# EAGLE design LayerOne_2011 (EAGLE 5.11)
MOUSER: 556-ATMEGA64A-AU; OC_NEWARK: unknown

## Sheet 1 of 5
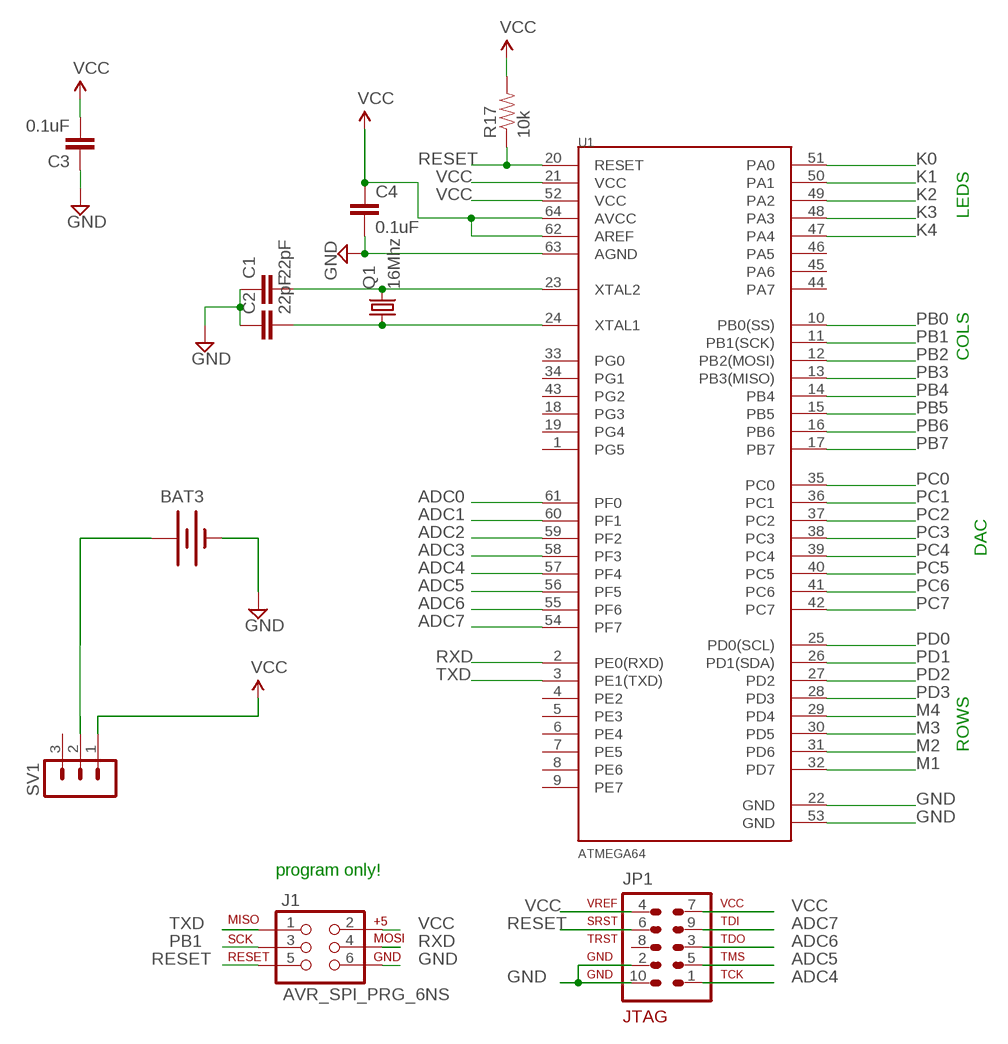
[diagram p0: schematic, sheet 1]

### Parts
BAT3  BATTERYCR123A  [BATTERY_CR123A]
C1  22pF  CAP0805  [0805]
C2  22pF  CAP0805  [0805]
C3  0.1uF  CAP0805  [0805]
C4  0.1uF  CAP0805  [0805]
J1  AVR_SPI_PRG_6NS  [2X3-NS]
JP1  debug  AVR-JTAG-10  [AVR-JTAG-10]
Q1  16Mhz  CRYSTALSMD  [HC49UP]
R17  10k  RESISTOR  [0805]
SV1  MA03-1  [MA03-1]
U1  ATMEGA64  ATMEGA128-SMD  [TQFP64_14X14MM]

### Nets
3V: BAT3.+ SV1.2
ADC0: U1.61(PF0) ; also sheet 5
ADC1: U1.60(PF1) ; also sheet 5
ADC2: U1.59(PF2) ; also sheet 5
ADC3: U1.58(PF3) ; also sheet 5
ADC4: JP1.1 U1.57(PF4) ; also sheet 5
ADC5: JP1.5 U1.56(PF5) ; also sheet 5
ADC6: JP1.3 U1.55(PF6) ; also sheet 5
ADC7: JP1.9 U1.54(PF7) ; also sheet 5
GND: BAT3.- C1.1 C2.1 C3.1 C4.2 J1.6 JP1.2 JP1.10 U1.22(GND) U1.53(GND) U1.63(AGND) ; also sheet 2,5
K0 [LED]: U1.51(PA0) ; also sheet 4
K1 [LED]: U1.50(PA1) ; also sheet 4
K2 [LED]: U1.49(PA2) ; also sheet 4
K3 [LED]: U1.48(PA3) ; also sheet 4
K4 [LED]: U1.47(PA4) ; also sheet 4
M1: U1.32(PD7) ; also sheet 3
M2: U1.31(PD6) ; also sheet 3
M3: U1.30(PD5) ; also sheet 3
M4: U1.29(PD4) ; also sheet 3
N$15: C2.2 Q1.1 U1.24(XTAL1)
N$55: C1.2 Q1.2 U1.23(XTAL2)
PB0: U1.10(PB0(SS)) ; also sheet 3
PB1: J1.3 U1.11(PB1(SCK)) ; also sheet 3
PB2: U1.12(PB2(MOSI)) ; also sheet 3
PB3: U1.13(PB3(MISO)) ; also sheet 3
PB4: U1.14(PB4)
PB5: U1.15(PB5)
PB6: U1.16(PB6)
PB7: U1.17(PB7)
PC0: U1.35(PC0) ; also sheet 2
PC1: U1.36(PC1) ; also sheet 2
PC2: U1.37(PC2) ; also sheet 2
PC3: U1.38(PC3) ; also sheet 2
PC4: U1.39(PC4) ; also sheet 2
PC5: U1.40(PC5) ; also sheet 2
PC6: U1.41(PC6) ; also sheet 2
PC7: U1.42(PC7) ; also sheet 2
PD0: U1.25(PD0(SCL))
PD1: U1.26(PD1(SDA))
PD2: U1.27(PD2)
PD3: U1.28(PD3)
RESET: J1.5 JP1.6 R17.1 U1.20(RESET)
RXD: J1.4 U1.2(PE0(RXD))
TXD: J1.1 U1.3(PE1(TXD))
VCC: C3.2 C4.1 J1.2 JP1.4 JP1.7 R17.2 SV1.1 U1.21(VCC) U1.52(VCC) U1.62(AREF) U1.64(AVCC) ; also sheet 5
Unconnected: JP1.8 SV1.3 U1.1(PG5) U1.4(PE2) U1.5(PE3) U1.6(PE4) U1.7(PE5) U1.8(PE6) U1.9(PE7) U1.18(PG3) U1.19(PG4) U1.33(PG0) U1.34(PG1) U1.43(PG2) U1.44(PA7) U1.45(PA6) U1.46(PA5)

### Notes on the sheet
- LEDS
- COLS
- DAC
- ROWS
- program only!

## Sheet 2 of 5
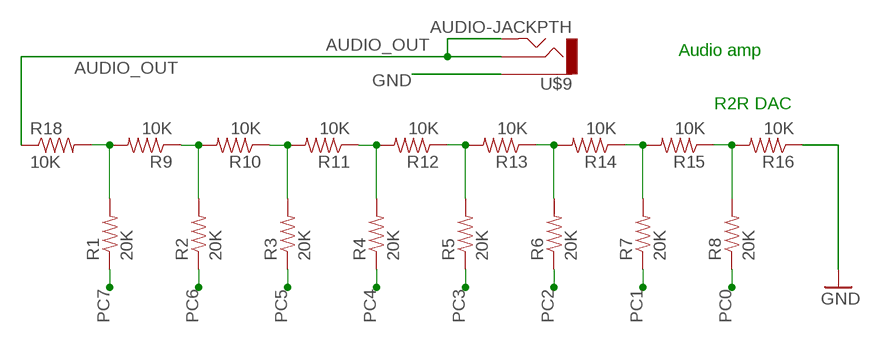
[diagram p1: schematic, sheet 2]

### Parts
R1  20K  RESISTOR  [0805]
R2  20K  RESISTOR  [0805]
R3  20K  RESISTOR  [0805]
R4  20K  RESISTOR  [0805]
R5  20K  RESISTOR  [0805]
R6  20K  RESISTOR  [0805]
R7  20K  RESISTOR  [0805]
R8  20K  RESISTOR  [0805]
R9  10K  RESISTOR  [0805]
R10  10K  RESISTOR  [0805]
R11  10K  RESISTOR  [0805]
R12  10K  RESISTOR  [0805]
R13  10K  RESISTOR  [0805]
R14  10K  RESISTOR  [0805]
R15  10K  RESISTOR  [0805]
R16  10K  RESISTOR  [0805]
R18  10K  RESISTOR  [0805]
U$9  AUDIO-JACKPTH  LAYERONE_2011_AUDIO-JACKPTH  [LAYERONE_2011_AUDIO-JACK]

### Nets
AUDIO_OUT: R18.1 U$9.2 U$9.5
GND: R16.1 U$9.1 ; also sheet 1,5
N$1: R2.2 R9.1 R10.2
N$2: R3.2 R10.1 R11.2
N$3: R4.2 R11.1 R12.2
N$4: R5.2 R12.1 R13.2
N$5: R6.2 R13.1 R14.2
N$6: R7.2 R14.1 R15.2
N$7: R8.2 R15.1 R16.2
N$53: R1.2 R9.2 R18.2
PC0: R8.1 ; also sheet 1
PC1: R7.1 ; also sheet 1
PC2: R6.1 ; also sheet 1
PC3: R5.1 ; also sheet 1
PC4: R4.1 ; also sheet 1
PC5: R3.1 ; also sheet 1
PC6: R2.1 ; also sheet 1
PC7: R1.1 ; also sheet 1

### Notes on the sheet
- Audio amp
- R2R DAC

## Sheet 3 of 5
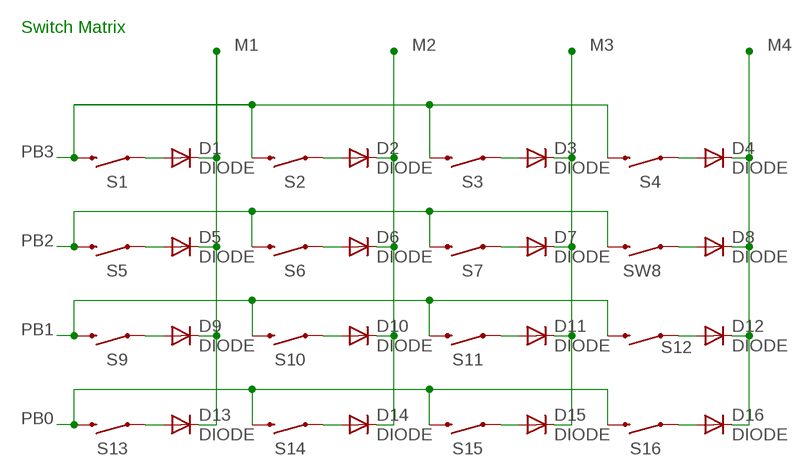
[diagram p2: schematic, sheet 3]

### Parts
D1  DIODE  DIODESOD  [SOD-323]
D2  DIODE  DIODESOD  [SOD-323]
D3  DIODE  DIODESOD  [SOD-323]
D4  DIODE  DIODESOD  [SOD-323]
D5  DIODE  DIODESOD  [SOD-323]
D6  DIODE  DIODESOD  [SOD-323]
D7  DIODE  DIODESOD  [SOD-323]
D8  DIODE  DIODESOD  [SOD-323]
D9  DIODE  DIODESOD  [SOD-323]
D10  DIODE  DIODESOD  [SOD-323]
D11  DIODE  DIODESOD  [SOD-323]
D12  DIODE  DIODESOD  [SOD-323]
D13  DIODE  DIODESOD  [SOD-323]
D14  DIODE  DIODESOD  [SOD-323]
D15  DIODE  DIODESOD  [SOD-323]
D16  DIODE  DIODESOD  [SOD-323]
S1  wave A saw/squ  SWITCH-MOMENTARY-2SMD  [TACTILE_SWITCH_SMD]
S2  osc b on/off  SWITCH-MOMENTARY-2SMD  [TACTILE_SWITCH_SMD]
S3  modwheel  SWITCH-MOMENTARY-2SMD  [TACTILE_SWITCH_SMD]
S4  transpose down/up  SWITCH-MOMENTARY-2SMD  [TACTILE_SWITCH_SMD]
S5  wave B square/saw  SWITCH-MOMENTARY-2SMD  [TACTILE_SWITCH_SMD]
S6  octave B down  SWITCH-MOMENTARY-2SMD  [TACTILE_SWITCH_SMD]
S7  OSCA noise toggle  SWITCH-MOMENTARY-2SMD  [TACTILE_SWITCH_SMD]
S9  DCF KBD TRACK off/on  SWITCH-MOMENTARY-2SMD  [TACTILE_SWITCH_SMD]
S10  DCF HP/LP  SWITCH-MOMENTARY-2SMD  [TACTILE_SWITCH_SMD]
S11  LFO Mod DCO/DCF  SWITCH-MOMENTARY-2SMD  [TACTILE_SWITCH_SMD]
S12  LFO KBD Sync  SWITCH-MOMENTARY-2SMD  [TACTILE_SWITCH_SMD]
S13  DCO distort toggle  SWITCH-MOMENTARY-2SMD  [TACTILE_SWITCH_SMD]
S14  knob bank shift  SWITCH-MOMENTARY-2SMD  [TACTILE_SWITCH_SMD]
S15  LFO WAVE tri/squa  SWITCH-MOMENTARY-2SMD  [TACTILE_SWITCH_SMD]
S16  LFO Normal/Rand  SWITCH-MOMENTARY-2SMD  [TACTILE_SWITCH_SMD]
SW8  DCA Gate/env  SWITCH-MOMENTARY-2SMD  [TACTILE_SWITCH_SMD]

### Nets
M1: D1.1(C) D5.1(C) D9.1(C) D13.1(C) ; also sheet 1
M2: D2.1(C) D6.1(C) D10.1(C) D14.1(C) ; also sheet 1
M3: D3.1(C) D7.1(C) D11.1(C) D15.1(C) ; also sheet 1
M4: D4.1(C) D8.1(C) D12.1(C) D16.1(C) ; also sheet 1
N$13: D1.2(A) S1.1
N$16: D2.2(A) S2.1
N$17: D3.2(A) S3.1
N$18: D4.2(A) S4.1
N$19: D5.2(A) S5.1
N$20: D6.2(A) S6.1
N$21: D7.2(A) S7.1
N$22: D8.2(A) SW8.1
N$23: D9.2(A) S9.1
N$24: D10.2(A) S10.1
N$25: D11.2(A) S11.1
N$26: D12.2(A) S12.1
N$33: D13.2(A) S13.1
N$34: D14.2(A) S14.1
N$35: D15.2(A) S15.1
N$36: D16.2(A) S16.1
PB0: S13.3 S14.3 S15.3 S16.3 ; also sheet 1
PB1: S9.3 S10.3 S11.3 S12.3 ; also sheet 1
PB2: S5.3 S6.3 S7.3 SW8.3 ; also sheet 1
PB3: S1.3 S2.3 S3.3 S4.3 ; also sheet 1

### Notes on the sheet
- Switch Matrix

## Sheet 4 of 5
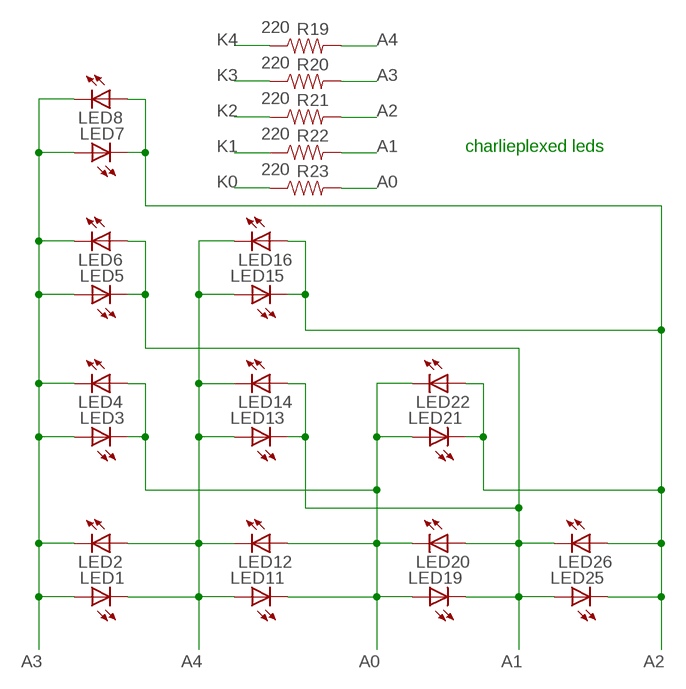
[diagram p3: schematic, sheet 4]

### Parts
LED1  LEDCHIPLED_1206  [CHIPLED_1206]
LED2  LEDCHIPLED_1206  [CHIPLED_1206]
LED3  LEDCHIPLED_1206  [CHIPLED_1206]
LED4  LEDCHIPLED_1206  [CHIPLED_1206]
LED5  LEDCHIPLED_1206  [CHIPLED_1206]
LED6  LEDCHIPLED_1206  [CHIPLED_1206]
LED7  LEDCHIPLED_1206  [CHIPLED_1206]
LED8  LEDCHIPLED_1206  [CHIPLED_1206]
LED11  LEDCHIPLED_1206  [CHIPLED_1206]
LED12  LEDCHIPLED_1206  [CHIPLED_1206]
LED13  LEDCHIPLED_1206  [CHIPLED_1206]
LED14  LEDCHIPLED_1206  [CHIPLED_1206]
LED15  LEDCHIPLED_1206  [CHIPLED_1206]
LED16  LEDCHIPLED_1206  [CHIPLED_1206]
LED19  LEDCHIPLED_1206  [CHIPLED_1206]
LED20  LEDCHIPLED_1206  [CHIPLED_1206]
LED21  LEDCHIPLED_1206  [CHIPLED_1206]
LED22  LEDCHIPLED_1206  [CHIPLED_1206]
LED25  LEDCHIPLED_1206  [CHIPLED_1206]
LED26  LEDCHIPLED_1206  [CHIPLED_1206]
R19  220  RESISTOR  [0805]
R20  220  RESISTOR  [0805]
R21  220  RESISTOR  [0805]
R22  220  RESISTOR  [0805]
R23  220  RESISTOR  [0805]

### Nets
A0 [LED]: LED3.C LED4.A LED11.C LED12.A LED19.A LED20.C LED21.A LED22.C R23.2
A1: LED5.C LED6.A LED13.C LED14.A LED19.C LED20.A LED25.A LED26.C R22.2
A2: LED7.C LED8.A LED15.C LED16.A LED21.C LED22.A LED25.C LED26.A R21.2
A3: LED1.A LED2.C LED3.A LED4.C LED5.A LED6.C LED7.A LED8.C R20.2
A4: LED1.C LED2.A LED11.A LED12.C LED13.A LED14.C LED15.A LED16.C R19.2
K0 [LED]: R23.1 ; also sheet 1
K1 [LED]: R22.1 ; also sheet 1
K2 [LED]: R21.1 ; also sheet 1
K3 [LED]: R20.1 ; also sheet 1
K4 [LED]: R19.1 ; also sheet 1

### Notes on the sheet
- charlieplexed leds

## Sheet 5 of 5
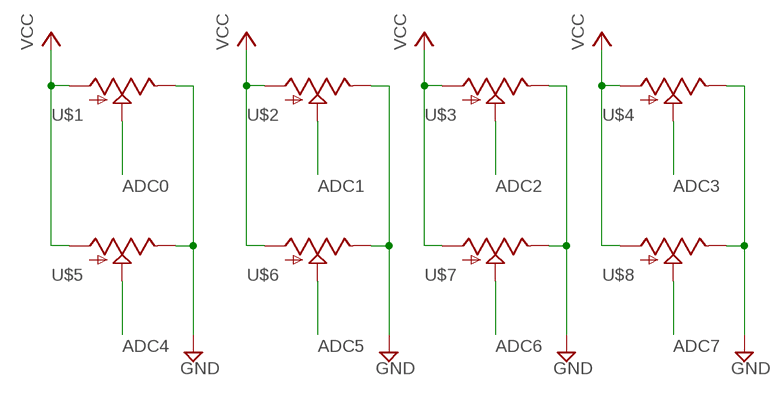
[diagram p4: schematic, sheet 5]

### Parts
U$1  LAYERONE_2011_POTPOT_GOLD  [LAYERONE_2011_POT_GOLD]
U$2  LAYERONE_2011_POTPOT_GOLD  [LAYERONE_2011_POT_GOLD]
U$3  LAYERONE_2011_POTPOT_GOLD  [LAYERONE_2011_POT_GOLD]
U$4  LAYERONE_2011_POTPOT_GOLD  [LAYERONE_2011_POT_GOLD]
U$5  LAYERONE_2011_POTPOT_GOLD  [LAYERONE_2011_POT_GOLD]
U$6  LAYERONE_2011_POTPOT_GOLD  [LAYERONE_2011_POT_GOLD]
U$7  LAYERONE_2011_POTPOT_GOLD  [LAYERONE_2011_POT_GOLD]
U$8  LAYERONE_2011_POTPOT_GOLD  [LAYERONE_2011_POT_GOLD]

### Nets
ADC0: U$1.P$2(S) ; also sheet 1
ADC1: U$2.P$2(S) ; also sheet 1
ADC2: U$3.P$2(S) ; also sheet 1
ADC3: U$4.P$2(S) ; also sheet 1
ADC4: U$5.P$2(S) ; also sheet 1
ADC5: U$6.P$2(S) ; also sheet 1
ADC6: U$7.P$2(S) ; also sheet 1
ADC7: U$8.P$2(S) ; also sheet 1
GND: U$1.P$3(E) U$2.P$3(E) U$3.P$3(E) U$4.P$3(E) U$5.P$3(E) U$6.P$3(E) U$7.P$3(E) U$8.P$3(E) ; also sheet 1,2
VCC: U$1.P$1(A) U$2.P$1(A) U$3.P$1(A) U$4.P$1(A) U$5.P$1(A) U$6.P$1(A) U$7.P$1(A) U$8.P$1(A) ; also sheet 1

## Library data of the parts
BAT3 = tvbgone-adj:BATTERY: Battery Holders Various common sizes : AA, AAA, 20mm coin cell and 12mm coin cell.
C1-C3 = SparkFun:CAP: Capacitor Standard 0603 ceramic capacitor, and 0.1" leaded capacitor.
C4 = NSL_Cylon:CAP: Capacitor Standard 0603 ceramic capacitor, and 0.1" leaded capacitor.
D1-D16 = SparkFun:DIODE: Diode These are standard reverse protection diodes and small signal diodes. SMA package can handle up to about 1A. SOD-323 can handle about 200mA. What the SOD-323 package when ordering, there are some mfgs out there that are 5-pin packages.
J1 = LayerOne_2011:AVR_SPI_PRG_6: AVR ISP 6 Pin This is the reduced ISP connector for AVR programming. Common on Arduino. This footprint will take up less PCB space and can be used with a 10-pin to 6-pin adapter such as SKU: BOB-08508
JP1 = avr-6:AVR-JTAG-10: AVR JTAG Debug/Programming Header
LED1-LED8 LED11-LED16 LED19-LED22 LED25 LED26 = led:LED: LED OSRAM: - CHIPLED LG R971, LG N971, LY N971, LG Q971, LY Q971, LO R971, LY R971 LH N974, LH R974 LS Q976, LO Q976, LY Q976 LO Q996 - Hyper CHIPLED LW Q18S LB Q993, LB Q99A, LB R99A - SideLED LS A670, LO A670, LY A670, LG A670, LP A670 LB A673, LV A673, LT A673, LW A673 LH A674 LY A675 LS A676, LA A676, LO A676, LY A676, LW A676 LS A679, LY A679, LG A679 - Hyper Micro SIDELED® LS Y876, LA Y876, LO Y876, LY Y876 LT Y87S - SmartLED LW L88C, LW L88S LB L89C, LB L89S, LG L890 LS L89K, LO L89K, LY L89K LS L896, LA L896, LO L896, LY L896 - TOPLED LS T670, LO T670, LY T670, LG T670, LP T670 LSG T670, LSP T670, LSY T670, LOP T670, LYG T670 LG T671, LOG T671, LSG T671 LB T673, LV T673, LT T673, LW T673 LH T674 LS T676, LA T676, LO T676, LY T676, LB T676, LH T676, LSB T676, LW T676 LB T67C, LV T67C, LT T67C, LS T67K, LO T67K, LY T67K, LW E67C LS E67B, LA E67B, LO E67B, LY E67B, LB E67C, LV E67C, LT E67C LW T67C LS T679, LY T679, LG T679 LS T770, LO T770, LY T770, LG T770, LP T770 LB T773, LV T773, LT T773, LW T773 LH T774 LS E675, LA E675, LY E675, LS T675 LS T776, LA T776, LO T776, LY T776, LB T776 LHGB T686 LT T68C, LB T68C - Hyper Mini TOPLED® LB M676 - Mini TOPLED Santana® LG M470 LS M47K, LO M47K, LY M47K Source: http://www.osram.convergy.de LUXEON: - LUMILED® LXK2-PW12-R00, LXK2-PW12-S00, LXK2-PW14-U00, LXK2-PW14-V00 LXK2-PM12-R00, LXK2-PM12-S00, LXK2-PM14-U00 LXK2-PE12-Q00, LXK2-PE12-R00, LXK2-PE12-S00, LXK2-PE14-T00, LXK2-PE14-U00 LXK2-PB12-K00, LXK2-PB12-L00, LXK2-PB12-M00, LXK2-PB14-N00, LXK2-PB14-P00, LXK2-PB14-Q00 LXK2-PR12-L00, LXK2-PR12-M00, LXK2-PR14-Q00, LXK2-PR14-R00 LXK2-PD12-Q00, LXK2-PD12-R00, LXK2-PD12-S00 LXK2-PH12-R00, LXK2-PH12-S00 LXK2-PL12-P00, LXK2-PL12-Q00, LXK2-PL12-R00 Source: www.luxeon.com KINGBRIGHT: KA-3528ASYC Source: www.kingbright.com
Q1 = LayerOne_2011:CRYSTAL: Crystals Various standard crystals. Proven footprints. Spark Fun Electronics SKU : COM-00534
R1-R17 = SparkFun:RESISTOR: Resistor Basic schematic elements and footprints for 0603, 1206, and PTH 1/10th watt (small) resistors.
R18 = LayerOne_2011:RESISTOR: Resistor Basic schematic elements and footprints for 0603, 1206, and PTH 1/10th watt (small) resistors.
R19-R23 = NSL:RESISTOR: Resistor Basic schematic elements and footprints for 0603, 1206, and PTH 1/10th watt (small) resistors.
S1-S7 S9-S16 SW8 = SparkFun:SWITCH-MOMENTARY-2
SV1 = con-lstb:MA03-1: PIN HEADER; OC_FARNELL: unknown; OC_NEWARK: unknown
U1 = LayerOne_2011:ATMEGA128: ATmega128/128L/1281/2561. Note: The ATmega128 pin 1 is PEN and the ATmega256/1281 pin 1 is PG5.
U$1-U$8 = LayerOne_2011:LAYERONE_2011_POT
U$9 = LayerOne_2011:LAYERONE_2011_AUDIO-JACK: 3.5mm Audio Jack Simple 3.5mm common PCB mount audio jack. SKU: PRT-08032

## Net classes
0 default: width 0.406 mm
1 LED: width 0.305 mm

## Board
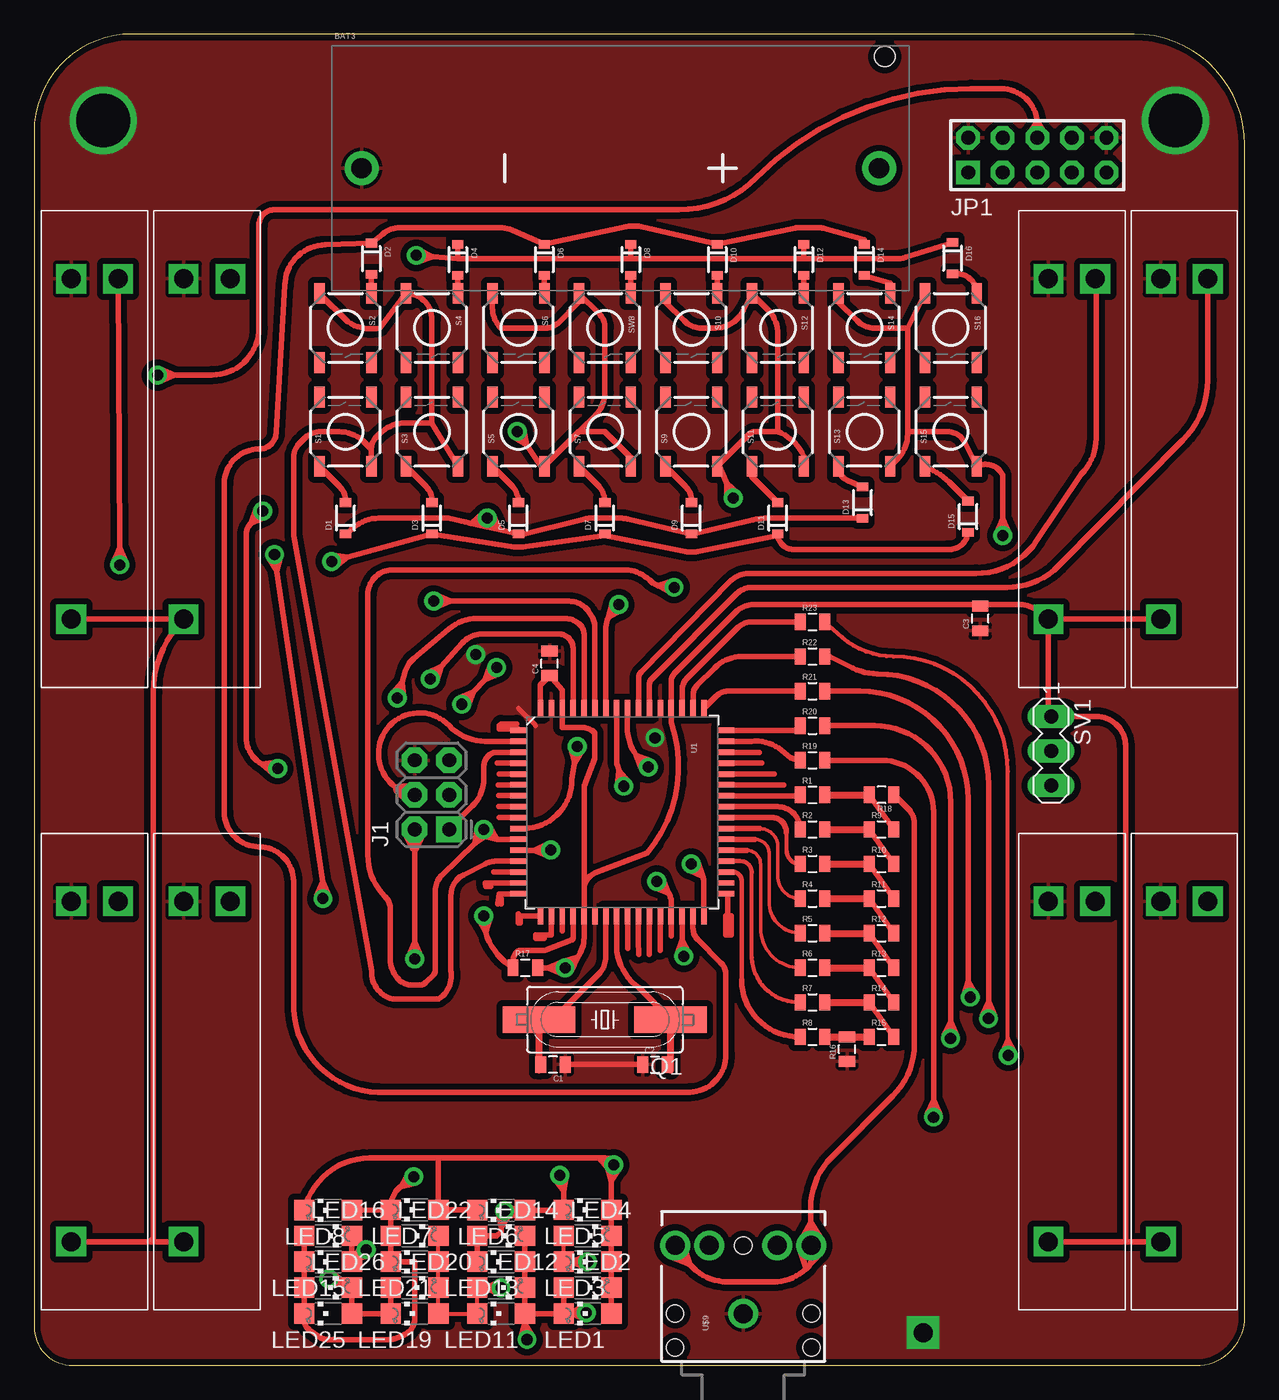
[diagram p5: board, top side]
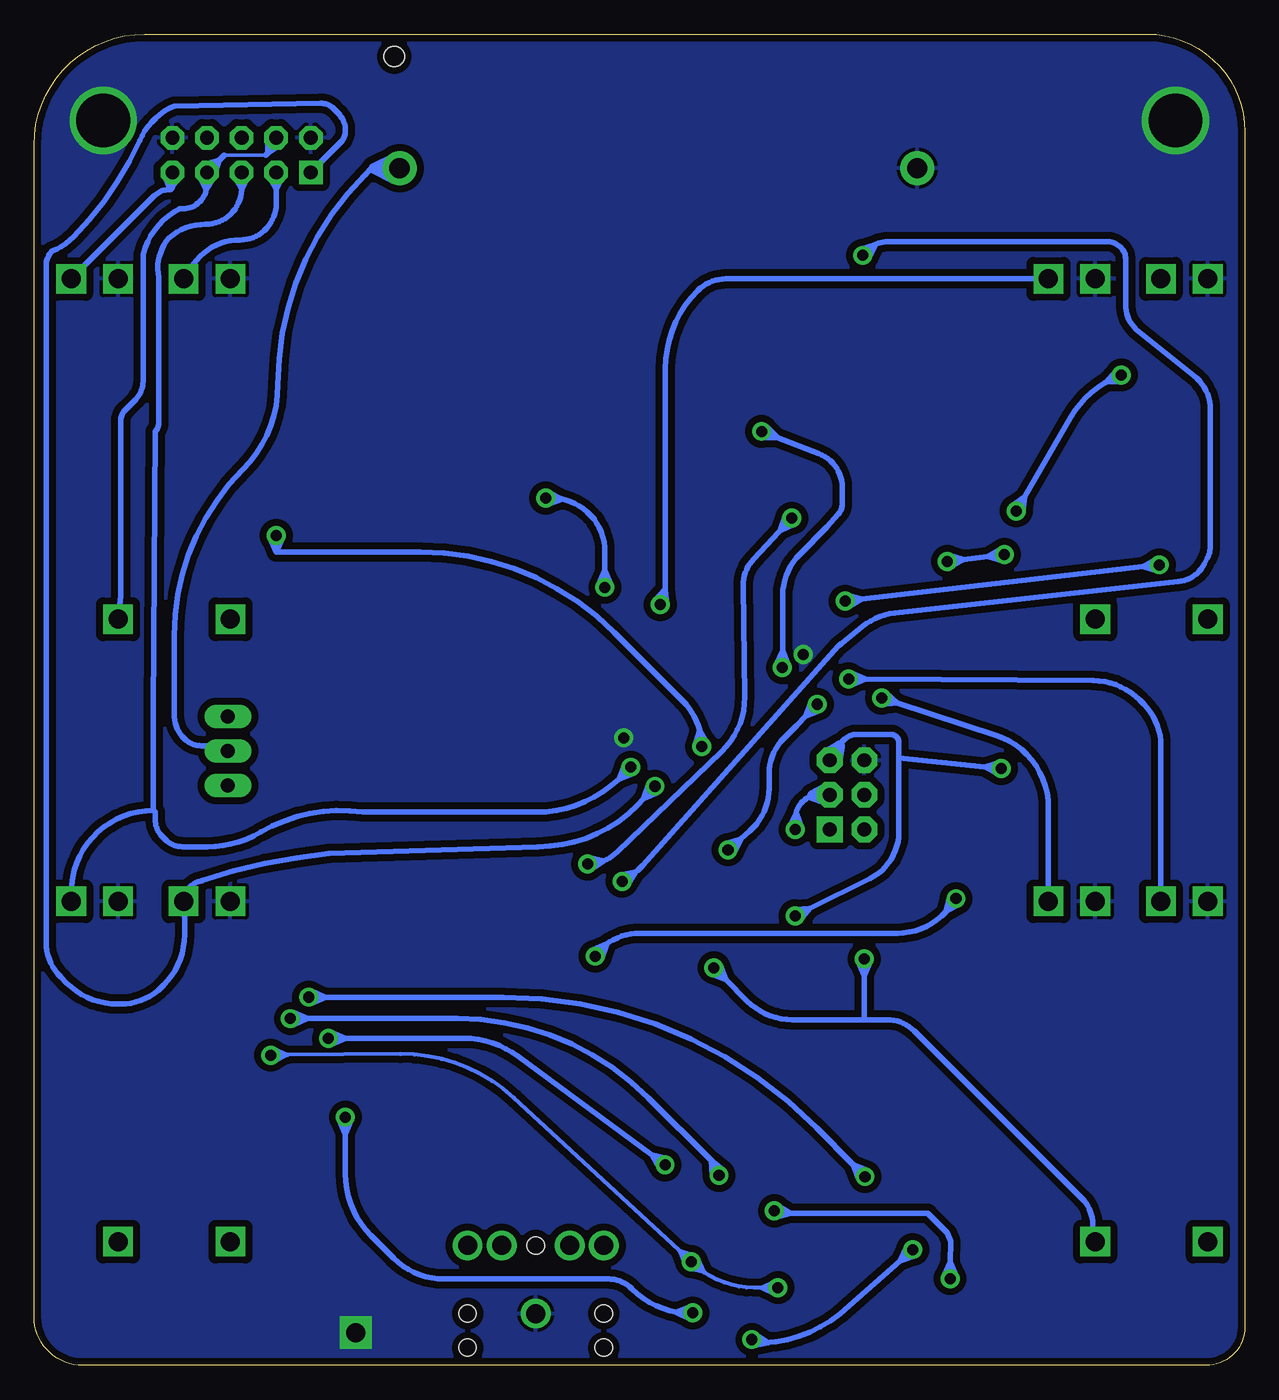
[diagram p6: board, bottom side, seen from below]

Size 88.9 x 97.79 mm. Coordinates in mm from the lower left corner, seen from the top.
Outline: 85.31,0 arc90 88.9,3.59 88.9,89.66 arc90 80.77,97.79 7.18,97.79 arc90 0,90.61 0,2.84 arc90 2.84,0 85.31,0
Copper layers (1*16): Top 0.0356mm / dielectric 1.5011mm / Bottom 0.0356mm
Design rules "SparkFun-mod *": minimum track width 8mil, minimum drill 32mil, track to track 14mil, track to pad 14mil, pad to pad 12mil, via to via 12mil, smd to smd 8mil, copper to edge 12mil, drill to drill 8mil, minimum pad ring 14mil, minimum via ring 10mil, stop-mask expansion 25mil, vias tented up to drill 34mil, thermal gap 10mil
Milling: 8 lines

### Footprints (pad centres in the part's own frame; a part is rotated, then mirrored left to right if it is on the bottom)
BATTERY_CR123A = drill 1.5 pad 2.5 round: + 19,0; - -19,0 | hole 1.5: 19.4,8.2
0805 = smd 0.8 x 1.2: 1 -0.9,0; 2 0.9,0
SOD-323 = smd 0.63 x 0.83: 1 -1.15,0; 2 1.15,0
2X3-NS = drill 1.016 pad 1.88 square: 1 -2.54,-1.27 | drill 1.016 pad 1.88 octagon: 2 -2.54,1.27; 3 0,-1.27; 4 0,1.27; 5 2.54,-1.27; 6 2.54,1.27
AVR-JTAG-10 = drill 1.016 square: 1 -5.08,-1.27 | drill 1.016 octagon: 2 -5.08,1.27; 3 -2.54,-1.27; 4 -2.54,1.27; 5 0,-1.27; 6 0,1.27; 7 2.54,-1.27; 8 2.54,1.27; 9 5.08,-1.27; 10 5.08,1.27
CHIPLED_1206 = smd 1.5 x 1.5: A 0,-1.75; C 0,1.75
HC49UP = smd 5.334 x 1.93: 1 -4.826,0; 2 4.826,0
TACTILE_SWITCH_SMD = smd 1.524 x 0.762: 1 -2.54,1.905; 2 2.54,1.905; 3 -2.54,-1.905; 4 2.54,-1.905
MA03-1 = drill 1.016 long: 1 -2.54,0; 2 0,0; 3 2.54,0
TQFP64_14X14MM = smd 0.4 x 1.27: 1 -6,-7.6; 2 -5.2,-7.6; 3 -4.4,-7.6; 4 -3.6,-7.6; 5 -2.8,-7.6; 6 -2,-7.6; 7 -1.2,-7.6; 8 -0.4,-7.6; 9 0.4,-7.6; 10 1.2,-7.6; 11 2,-7.6; 12 2.8,-7.6; 13 3.6,-7.6; 14 4.4,-7.6; 15 5.2,-7.6; 16 6,-7.6; 33 6,7.6; 34 5.2,7.6; 35 4.4,7.6; 36 3.6,7.6; 37 2.8,7.6; 38 2,7.6; 39 1.2,7.6; 40 0.4,7.6; 41 -0.4,7.6; 42 -1.2,7.6; 43 -2,7.6; 44 -2.8,7.6; 45 -3.6,7.6; 46 -4.4,7.6; 47 -5.2,7.6; 48 -6,7.6 | smd 1.27 x 0.4: 17 7.6,-6; 18 7.6,-5.2; 19 7.6,-4.4; 20 7.6,-3.6; 21 7.6,-2.8; 22 7.6,-2; 23 7.6,-1.2; 24 7.6,-0.4; 25 7.6,0.4; 26 7.6,1.2; 27 7.6,2; 28 7.6,2.8; 29 7.6,3.6; 30 7.6,4.4; 31 7.6,5.2; 32 7.6,6; 49 -7.6,6; 50 -7.6,5.2; 51 -7.6,4.4; 52 -7.6,3.6; 53 -7.6,2.8; 54 -7.6,2; 55 -7.6,1.2; 56 -7.6,0.4; 57 -7.6,-0.4; 58 -7.6,-1.2; 59 -7.6,-2; 60 -7.6,-2.8; 61 -7.6,-3.6; 62 -7.6,-4.4; 63 -7.6,-5.2; 64 -7.6,-6
LAYERONE_2011_POT_GOLD = drill 1.397 square: P$1 12.5,-1.72; P$2 -12.5,1.72; P$3 -12.5,-1.72
LAYERONE_2011_AUDIO-JACK = drill 1.397 pad 2.184 round: 1 0,0; 2 5,5; 3 5,2.5; 4 5,-2.5; 5 5,-5 | hole 1.27: 0,5; -2.5,5; -2.5,-5; 0,-5; 5,0

### Placement (x,y rotation side)
BAT3  43.05,87.93 0 top
C1  38.1,22.1 180 top
C2  45.59,22.1 0 top
C3  69.47,54.86 90 top
C4  37.85,51.56 90 top
D1  22.86,62.23 90 top
D2  24.77,81.28 270 top
D3  29.21,62.23 90 top
D4  31.11,81.2 270 top
D5  35.56,62.23 90 top
D6  37.46,81.2 270 top
D7  41.91,62.23 90 top
D8  43.81,81.2 270 top
D9  48.26,62.23 90 top
D10  50.16,81.2 270 top
D11  54.61,62.23 90 top
D12  56.52,81.2 270 top
D13  60.83,63.37 90 top
D14  60.96,81.2 270 top
D15  68.58,62.34 90 top
D16  67.44,81.33 270 top
J1  29.21,41.91 90 top
JP1  73.66,88.9 0 top
LED1  40.64,3.81 90 top
LED2  40.64,5.71 270 top
LED3  40.64,7.62 90 top
LED4  40.64,9.53 270 top
LED5  40.64,11.43 90 top
LED6  34.29,11.4 90 top
LED7  27.94,11.43 90 top
LED8  21.59,11.4 90 top
LED11  34.29,3.81 90 top
LED12  34.29,5.71 270 top
LED13  34.29,7.62 90 top
LED14  34.29,9.53 270 top
LED15  21.59,7.62 90 top
LED16  21.59,9.53 270 top
LED19  27.94,3.81 90 top
LED20  27.94,5.71 270 top
LED21  27.94,7.62 90 top
LED22  27.94,9.53 270 top
LED25  21.59,3.81 90 top
LED26  21.59,5.71 270 top
Q1  41.91,25.4 180 top
R1  4.7K  [0805]  57.15,41.91 0 top
R2  4.7K  [0805]  57.15,39.37 0 top
R3  4.7K  [0805]  57.15,36.83 0 top
R4  4.7K  [0805]  57.15,34.29 0 top
R5  4.7K  [0805]  57.15,31.75 0 top
R6  4.7K  [0805]  57.15,29.21 0 top
R7  4.7K  [0805]  57.15,26.67 0 top
R8  4.7K  [0805]  57.15,24.13 0 top
R9  2.4K  [0805]  62.23,39.37 0 top
R10  2.4K  [0805]  62.23,36.83 0 top
R11  2.4K  [0805]  62.23,34.29 0 top
R12  2.4K  [0805]  62.23,31.75 0 top
R13  2.4K  [0805]  62.23,29.21 0 top
R14  2.4K  [0805]  62.23,26.67 0 top
R15  2.4K  [0805]  62.23,24.13 0 top
R16  2.4K  [0805]  59.69,23.24 90 top
R17  36.07,29.21 0 top
R18  0K  [0805]  62.23,41.91 180 top
R19  57.15,44.45 0 top
R20  57.15,46.99 0 top
R21  57.15,49.53 0 top
R22  57.15,52.07 0 top
R23  57.15,54.61 0 top
S1  22.86,68.58 90 top
S2  22.86,76.2 270 top
S3  29.21,68.58 90 top
S4  29.21,76.2 270 top
S5  35.56,68.58 90 top
S6  35.56,76.2 270 top
S7  41.91,68.58 90 top
S9  48.26,68.58 90 top
S10  48.26,76.2 270 top
S11  54.61,68.58 90 top
S12  54.61,76.2 270 top
S13  60.96,68.58 90 top
S14  60.96,76.2 270 top
S15  67.31,68.58 90 top
S16  67.31,76.2 270 top
SV1  74.68,45.14 270 top
SW8  41.91,76.2 270 top
U1  43.18,40.64 270 top
U$1  4.45,21.59 270 top
U$2  12.7,21.59 270 top
U$3  4.45,67.31 270 top
U$4  12.7,67.31 270 top
U$5  76.2,21.59 270 top
U$6  84.46,21.59 270 top
U$7  76.2,67.31 270 top
U$8  84.46,67.31 270 top
U$9  52.07,3.81 90 top

### Tracks (layer width: path | path; a pad name or v marks a point on that pad's centre or on a via)
3V
  Bottom 0.406: 64.59,87.48 arc-45 70.99,72.03 arc45 73.57,65.8 arc-45 78.61,53.63 78.61,47.84 arc-45 77.87,46.04 arc-45 76.6,45.52 75.06,45.52 SV1.2 | 64.59,87.48 64.07,88 64.01,87.93 63.93,87.93 BAT3.+ | 64.59,87.48 64.54,87.48
  Bottom 0.813: 63.93,87.93 62.43,88.69 BAT3.+ 62.43,87.18 63.93,87.93
A0  (via drill 0.81)
  Top 0.305: LED22.C LED21.A LED20.C LED19.A LED11.C LED12.A 33.07,5.71 | LED4.A LED3.C 39.42,7.62 | 33.07,5.71 v34.29,5.71 | v40.64,7.62 39.42,7.62 | 71.5,24 71.5,24.05 71.5,43.66 arc90 63.09,52.07 arc-41 59.35,53.47 R23.2 | v71.53,22.78 71.5,24 | 33.07,5.71 34.05,5.23 v34.29,5.71 | 33.07,5.71 34.05,6.2 v34.29,5.71 | 39.42,7.62 40.4,7.14 v40.64,7.62 | 39.42,7.62 40.4,8.1 v40.64,7.62 | 71.5,24 71.04,23.01 v71.53,22.78 | 71.5,24 72,23.03 v71.53,22.78
  Bottom 0.305: 39.7,6.84 arc-34 36.04,5.71 35.51,5.71 | 39.7,6.84 arc11 v40.64,7.62 | v34.29,5.71 35.51,5.71 | v40.64,7.62 41.54,8.45 | 41.54,8.45 53.68,19.66 arc-43 62,22.87 70.31,22.79 | 70.31,22.79 v71.53,22.78 | 35.51,5.71 34.53,6.2 v34.29,5.71 | 35.51,5.71 34.53,5.23 v34.29,5.71 | 39.7,6.84 40.77,7.1 v40.64,7.62 | 39.7,6.84 40.15,7.84 v40.64,7.62 | 41.54,8.45 40.49,8.14 v40.64,7.62 | 41.54,8.45 41.14,7.43 v40.64,7.62 | 70.31,22.79 71.28,22.3 v71.53,22.78 | 70.31,22.79 71.29,23.27 v71.53,22.78
A1  (via drill 0.81)
  Top 0.406: R22.2 58.42,52.07 60.11,51.22 arc27 61.91,50.8 arc-90 70.1,42.6 70.1,26.75 v70.08,25.48 | LED20.A LED19.C LED25.A LED26.C 23.37,5.89 23.37,6.1 22.83,6.1 | LED13.C LED14.A 33.98,9.52 34.29,9.83 34.29,10.16 | v38.61,13.97 38.89,13.69 38.89,12.78 | 38.89,12.78 LED5.C 38.87,11.4 LED6.A 35.86,11.23 35.76,11.23 | 22.83,6.1 22.55,6.1 v21.64,6.38 | 34.29,10.16 34.29,11.23 34.54,11.23 | 34.54,11.23 35.76,11.23 | v34.54,11.35 34.54,11.23 | 38.89,12.78 39.09,13.88 v38.61,13.97 | 38.89,12.78 38.22,13.68 v38.61,13.97 | 22.83,6.1 21.93,6.77 v21.64,6.38 | 22.83,6.1 21.73,5.9 v21.64,6.38 | v70.08,25.48 69.64,25.68 70.1,26.69 70.53,25.66 v70.08,25.48 | 34.29,10.16 34.94,11.07 v34.54,11.35 | 34.29,10.16 34.07,11.26 v34.54,11.35 | 35.76,11.23 34.78,11.78 v34.54,11.35 | 35.76,11.23 34.69,10.89 v34.54,11.35
  Bottom 0.406: 21.62,7.59 21.59,9.12 21.84,9.75 23.27,11.18 33.34,11.18 | 21.62,7.59 v21.64,6.38 | 68.86,25.48 57.81,25.48 arc45 43.8,19.67 39.18,15.05 | 68.86,25.48 v70.08,25.48 | 38.34,14.21 38.1,13.97 | 39.18,15.05 38.34,14.21 | 33.34,11.18 34.37,11.18 arc90 v34.54,11.35 | v38.61,13.97 38.51,14.07 38.48,14.07 38.34,14.21 | 39.18,15.05 38.3,14.35 v38.61,13.97 | 39.18,15.05 39.09,13.93 v38.61,13.97 | 21.62,7.59 21.19,6.56 v21.64,6.38 | 21.62,7.59 22.08,6.58 v21.64,6.38 | 68.86,25.48 69.88,25.03 v70.08,25.48 | 68.86,25.48 69.88,25.92 v70.08,25.48 | 33.34,11.18 34.42,10.88 v34.54,11.35 | 33.34,11.18 34.29,11.77 v34.54,11.35
A2  (via drill 0.81)
  Top 0.406: LED15.C LED16.A | LED15.C LED26.A LED25.C | LED7.C LED22.A LED21.C 27.94,7.62 27.94,3.41 arc-69 27.13,2.23 26.48,1.98 arc-21 26.09,1.9 21.56,1.9 arc-36 20.92,2.11 20.2,2.63 arc-54 19.84,3.34 LED15.C | 26.92,13.13 26.9,13.12 arc53 26.21,11.74 26.21,11.58 LED7.C | 26.92,13.13 v27.89,13.87 | 68.58,27.05 68.58,26.67 | 68.58,27.05 68.58,28.26 | 68.58,28.26 68.58,41.58 arc90 60.63,49.53 R21.2 | LED7.C LED8.A | v68.73,27.05 68.58,27.05 | 26.92,13.13 28,13.39 v27.89,13.87 | 26.92,13.13 27.46,14.11 v27.89,13.87 | 68.58,28.26 68.26,27.19 v68.73,27.05 | 68.58,28.26 69.15,27.3 v68.73,27.05
  Bottom 0.406: v27.89,13.87 28.75,14.73 | 28.75,14.73 31.44,17.46 arc-45 54.45,27.05 67.51,27.05 | 67.51,27.05 v68.73,27.05 | 28.75,14.73 27.71,14.32 v27.89,13.87 | 28.75,14.73 28.34,13.69 v27.89,13.87 | 67.51,27.05 68.54,26.6 v68.73,27.05 | 67.51,27.05 68.54,27.5 v68.73,27.05
A3  (via drill 0.81)
  Top 0.406: LED1.A LED2.C LED3.A LED4.C LED5.A 42.39,13.53 | 42.39,14.76 42.39,13.53 | v67.28,24.03 67.31,25.3 67.31,41.37 arc90 61.69,46.99 R20.2 | 29.69,15.24 LED7.A 32.52,11.43 LED6.C | 29.69,15.24 24.66,15.24 arc77 LED8.C | 29.69,15.24 41.46,15.24 | 41.46,15.24 41.91,15.24 42.39,14.76 | v42.57,14.73 42.39,14.76 | 42.39,13.53 42.98,14.47 v42.57,14.73 | 42.39,13.53 42.1,14.6 v42.57,14.73 | 41.46,15.24 42.21,14.41 v42.57,14.73 | 41.46,15.24 42.58,15.22 v42.57,14.73 | v67.28,24.03 66.84,24.23 67.31,25.25 67.74,24.21 v67.28,24.03
  Bottom 0.406: v42.57,14.73 42.55,14.73 43.54,15.47 | 43.54,15.47 53.34,22.7 arc-36 57.38,24.03 66.06,24.03 | 66.06,24.03 v67.28,24.03 | 43.54,15.47 42.46,15.21 v42.57,14.73 | 43.54,15.47 43,14.49 v42.57,14.73 | 66.06,24.03 67.09,23.58 v67.28,24.03 | 66.06,24.03 67.09,24.48 v67.28,24.03
A4  (via drill 0.81)
  Top 0.406: LED16.C LED15.A 23.46,7.72 | LED1.C LED2.A | LED11.A LED1.C | LED11.A LED12.C LED13.A LED14.C | 23.46,7.72 v24.38,8.51 | v36.2,1.9 36.04,2.64 36.04,3.11 | 36.04,3.11 LED11.A | 39.32,3.86 39.01,3.86 LED1.C | 39.32,3.86 v40.54,3.86 | 57.94,44.34 R19.2 62.23,44.45 arc-90 66.04,40.64 66.04,19.46 | v66.04,18.24 66.04,19.46 | 23.46,7.72 24.52,8.04 v24.38,8.51 | 23.46,7.72 23.95,8.72 v24.38,8.51 | 36.04,3.11 35.73,2.04 v36.2,1.9 | 36.04,3.11 36.61,2.16 v36.2,1.9 | 39.32,3.86 40.34,3.41 v40.54,3.86 | 39.32,3.86 40.34,4.31 v40.54,3.86 | 66.04,19.46 65.59,18.43 v66.04,18.24 | 66.04,19.46 66.49,18.43 v66.04,18.24
  Bottom 0.406: v36.2,1.9 35.33,1.65 arc-41 29.06,4.39 25.3,7.7 | v24.38,8.51 25.3,7.7 | v40.54,3.86 40.59,3.81 arc45 45.01,5.64 arc-45 46.72,6.35 58.79,6.35 arc45 62.49,7.88 64.18,9.57 arc45 66.04,14.06 66.04,17.02 | 66.04,17.02 v66.04,18.24 | 25.3,7.7 24.83,8.72 v24.38,8.51 | 25.3,7.7 24.23,8.04 v24.38,8.51 | v36.2,1.9 36.09,1.43 35,1.67 35.92,2.31 v36.2,1.9 | v40.54,3.86 40.71,4.32 41.76,3.92 40.76,3.42 v40.54,3.86 | 66.04,17.02 66.49,18.04 v66.04,18.24 | 66.04,17.02 65.59,18.04 v66.04,18.24
ADC0  (via drill 0.81)
  Top 0.406: v29.1,50.42 29.91,51.33 | 29.91,51.33 31.44,53.07 arc-49 32.89,53.72 38.59,53.72 arc-22 38.87,53.67 arc-68 39.58,52.62 U1.61 | 29.91,51.33 28.89,50.86 v29.1,50.42 | 29.91,51.33 29.56,50.27 v29.1,50.42
  Bottom 0.406: U$1.P$2 6.17,45.53 arc-45 7.42,48.57 7.74,48.88 arc-45 11.14,50.3 27.88,50.41 | 27.88,50.41 v29.1,50.42 | 27.88,50.41 28.91,49.97 v29.1,50.42 | 27.88,50.41 28.9,50.86 v29.1,50.42
ADC1  (via drill 0.81)
  Top 0.406: v26.67,49.02 27.02,50.19 | 27.02,50.19 27.27,51.01 arc-33 27.88,51.93 30.46,54.1 arc-40 32.55,54.86 38.98,54.86 arc-45 40.08,54.41 arc-45 40.39,53.66 U1.60 | 27.02,50.19 26.3,49.34 v26.67,49.02 | 27.02,50.19 27.15,49.08 v26.67,49.02
  Bottom 0.406: U$2.P$2 14.42,40.98 arc-72 18.27,46.28 25.51,48.64 | 25.51,48.64 v26.67,49.02 | 25.51,48.64 26.62,48.54 v26.67,49.02 | 25.51,48.64 26.35,49.39 v26.67,49.02
ADC2  (via drill 0.81)
  Top 0.406: v29.34,56.13 30.56,56.13 | 30.56,56.13 39.27,56.13 arc-58 40.78,55.3 40.97,54.98 arc-32 41.18,54.24 U1.59 | 6.28,60.02 U$3.P$2 | 6.28,60.02 v6.29,58.8 | 30.56,56.13 29.53,56.58 v29.34,56.13 | 30.56,56.13 29.53,55.69 v29.34,56.13 | 6.28,60.02 5.84,58.99 v6.29,58.8 | 6.28,60.02 6.73,59 v6.29,58.8
  Bottom 0.406: v6.29,58.8 7.5,58.66 | 7.5,58.66 28.13,56.27 | 28.13,56.27 v29.34,56.13 | 28.13,56.27 29.09,55.71 v29.34,56.13 | 28.13,56.27 29.19,56.6 v29.34,56.13 | 7.5,58.66 6.53,59.22 v6.29,58.8 | 7.5,58.66 6.43,58.33 v6.29,58.8
ADC3  (via drill 0.81)
  Top 0.406: v42.93,55.88 42.88,55.85 arc31 42.16,54.93 | 42.16,54.93 arc23 41.98,54.07 U1.58 | 42.16,54.93 43.15,55.45 v42.93,55.88 | 42.16,54.93 42.46,56.01 v42.93,55.88
  Bottom 0.406: U$4.P$2 38.11,79.81 arc-45 40.17,78.96 arc-45 42.55,73.22 42.55,57.07 arc1 42.55,57.04 | v42.93,55.88 42.62,55.88 42.44,55.93 | 42.44,55.93 42.55,57.04 | v42.93,55.88 42.44,55.93 | 42.55,57.04 43.29,56.2 v42.93,55.88
ADC4  (via drill 0.81)
  Top 0.406: U1.57 42.78,44.3 arc18 42.8,44.13 v43.31,42.54 | v43.31,42.54 42.82,42.6 42.94,43.71 43.67,42.87 v43.31,42.54
  Bottom 0.406: v43.31,42.54 44.13,41.64 | 44.13,41.64 44.6,41.13 arc45 51.91,38.1 67.25,37.59 arc-12 76.56,35.63 76.6,35.59 arc-46 77.75,34.79 U$5.P$2 77.92,33.09 77.85,33.02 | JP1.1 66.41,89.8 arc-45 66.04,90.7 arc-45 66.57,91.97 66.94,92.34 arc-45 67.84,92.71 78.61,92.51 arc-42 81.15,89.97 arc21 86,82.91 arc22 87.59,81.83 arc-45 88.01,80.81 88.01,31.1 arc-45 86.95,28.53 86.52,28.1 arc-45 82.75,26.54 82.56,26.54 arc-45 79.51,27.81 79.38,27.93 arc-45 77.85,31.63 77.85,33.02 | 77.85,33.02 77.85,33.53 | 44.13,41.64 43.77,42.7 v43.31,42.54 | 44.13,41.64 43.11,42.1 v43.31,42.54
ADC5  (via drill 0.81)
  Top 0.406: U1.56 43.56,48.22 43.56,46.64 arc30 44.23,44.81 arc19 v45.09,43.94 | v45.09,43.94 44.63,43.77 44.23,44.81 45.27,44.39 v45.09,43.94
  Bottom 0.406: 80.14,40.77 80.14,48.01 80.01,68.58 arc-45 79.76,69.19 79.76,79.93 arc49 79.02,82.81 arc41 76.3,83.82 arc-88 73.66,86.36 | 80.14,40.77 80.01,40.64 80.01,40.11 arc-45 79.48,38.84 79.27,38.63 arc-45 78,38.1 76.2,38.1 arc-30 72.26,39.17 arc38 64.77,40.64 52.07,40.64 arc-44 45.95,43.08 | 45.95,43.08 arc-1 45.78,43.24 v45.09,43.94 | 80.14,40.77 arc-90 86.18,34.73 U$6.P$2 | 73.66,86.36 arc-2 73.66,86.46 JP1.5 | 45.95,43.08 45.54,44.12 v45.09,43.94 | 45.95,43.08 44.91,43.49 v45.09,43.94 | 73.66,86.36 74.19,87.34 JP1.5 | 73.66,86.36 73.13,87.34 JP1.5
ADC6
  Top 0.406: U1.55 44.38,50.44 arc-45 44.58,50.94 51.16,57.63 arc-45 52.44,58.17 69.15,58.17 arc56 73.6,60.55 76.88,65.47 arc46 77.98,68.09 77.98,79.75 U$7.P$2
  Bottom 0.406: U$7.P$2 77.16,80.91 arc56 73.79,82.67 arc-90 71.12,85.33 71.12,86.36 | 71.12,86.36 JP1.3 | 71.12,86.36 71.66,87.34 JP1.3 | 71.12,86.36 70.59,87.34 JP1.3
ADC7
  Top 0.406: U1.54 45.18,50.03 arc-45 45.34,50.42 51.61,56.69 arc-45 52.72,57.15 71.41,57.15 arc45 75.24,58.75 84.36,67.95 arc45 86.18,72.38 U$8.P$2
  Bottom 0.406: U$8.P$2 80.08,85.91 arc45 78.98,86.36 arc-18 78.91,86.37 | 78.91,86.37 arc-72 78.74,86.6 JP1.9 | 78.91,86.37 79.31,87.41 JP1.9 | 78.91,86.37 78.25,87.27 JP1.9
AUDIO_OUT
  Top 0.406: R18.1 63.17,41.91 64.12,40.96 arc-45 64.64,39.69 64.64,23.62 arc-45 63.06,19.81 58.56,15.3 arc45 57.02,11.6 57.02,10.56 | 57.02,10.56 57.02,8.86 U$9.5 | U$9.2 47.07,8.48 48.13,7.42 | 48.13,7.42 48.35,7.2 arc45 50.89,6.15 54.27,6.15 arc43 56.7,7.1 | 56.7,7.1 arc2 56.8,7.2 arc45 57.07,7.84 U$9.5 | 48.13,7.42 47.7,8.79 U$9.2 | 48.13,7.42 46.74,7.99 U$9.2 | 57.02,10.56 56.29,9.24 U$9.5 | 57.02,10.56 57.82,9.28 U$9.5 | 56.7,7.1 57.72,8.21 U$9.5 | 56.7,7.1 56.23,8.53 U$9.5
GND  (via drill 0.81, 1.4 pad 1.78, 3.94)
  Top 0.356: 36.83,46.99 35.56,48.26
  Top 0.406: C1.1 C2.1
  other vias: 65.28,2.41 83.82,91.44 5.08,91.44 45.59,46.1 32.44,52.22
  pour Top (isolate 0.457): 88.9,0 88.9,89.66 arc90 80.77,97.79 7.41,97.79 arc90 0,90.38 0,0
  pour Bottom (isolate 0.508): 88.9,0 88.9,89.66 arc90 80.77,97.79 6.35,97.79 arc90 0,91.44 0,0
K0
  Top 0.406: U1.51 47.58,49.61 arc-45 47.94,50.48 51.6,54.14 arc-45 52.73,54.61 R23.1
K1
  Top 0.305: U1.50
  Top 0.406: R22.1 51.97,52.07 arc45 49.97,51.24 48.7,49.97 arc45 48.39,49.21 U1.50
K2
  Top 0.406: U1.49 50.1,49.16 arc-45 50.99,49.53 R21.1
K3
  Top 0.406: U1.48 55.9,46.64 R20.1
K4
  Top 0.406: U1.47 52.65,45.84 arc-45 54.89,45.18 55.57,44.63 arc45 56.17,44.58 R19.1
M1  (via drill 0.81)
  Top 0.406: D13.1 56,62.23 53.96,62.23 arc13 52.74,62.09 48.38,61.08 D9.1 43.61,62.16 arc13 42.98,62.23 40.87,62.23 arc14 40.42,62.17 35.56,60.96 D5.1 34.16,61.39 | 32.11,61.85 31.69,61.95 30.43,62.23 25.31,62.23 arc45 23.3,61.4 22.98,61.08 D1.1 | 33.27,61.59 32.11,61.85 | 33.27,61.59 34.16,61.39 | v48.26,36.83 48.89,36.2 arc-45 49.18,35.5 U1.32 | v33.27,62.23 33.27,61.59 | 48.72,36.99 | 48.72,36.99 49.08,35.93 | v48.26,36.83 48.72,36.99 | 48.06,36.38 49.08,35.93 | v48.26,36.83 48.06,36.38 | 33.23,61.74 32.11,61.85 | v33.27,62.23 33.23,61.74 | v33.27,62.23 33.72,62.42 | 33.11,61.77 34.16,61.39 | v33.27,62.23 33.11,61.77 | 48.72,36.99 49.08,35.93 | v48.26,36.83 48.72,36.99 | 48.06,36.38 49.08,35.93 | v48.26,36.83 48.06,36.38 | 33.23,61.74 32.11,61.85 | v33.27,62.23 33.23,61.74 | 32.11,61.85 32.95,62.59 v33.27,62.23 | 34.16,61.39 33.72,62.42 v33.27,62.23 | 33.11,61.77 34.16,61.39 | v33.27,62.23 33.11,61.77
  Bottom 0.406: v33.27,62.23 36.07,59.24 arc-43 36.83,57.3 36.73,49.09 arc47 38.4,45.11 46.09,37.73 arc22 47.06,37.07 | v48.26,36.83 arc-23 47.06,37.07 | 47.06,37.07 47.98,36.43 v48.26,36.83 | 47.06,37.07 48.16,37.31 v48.26,36.83 | v33.27,62.23 33.73,62.39 34.11,61.34 33.08,61.78 v33.27,62.23
M2
  Top 0.406: D14.1 60.96,82.68 57.94,83.52 arc16 57.62,83.57 56.1,83.57 arc12 55.9,83.54 D10.1 44.57,83.63 arc25 43.49,83.63 D6.1 35.12,83.37 arc24 34.2,83.57 26.89,83.57 arc39 25.59,83.1 D2.1 21.39,82.3 arc90 18.41,79.33 17.78,68.58 arc-90 16.51,67.31 arc90 13.97,64.77 13.97,40.64 arc90 16.51,38.1 arc-90 19.05,35.56 19.05,26.67 arc90 25.27,20.07 48.13,20.07 arc90 50.8,22.86 50.8,28.68 arc45 50.43,29.58 48.72,31.29 arc-45 48.38,32.11 U1.31
M3  (via drill 0.81)
  Top 0.406: 41.91,60.96 47.8,59.78 arc23 48.72,59.78 54.61,60.96 | 41.91,60.96 D7.1 | 41.91,60.96 35.85,60.11 arc-17 35.27,60.12 D3.1 23.02,59.38 | v21.84,59.05 23.02,59.38 | D15.1 arc-90 67.08,59.94 55.88,59.94 arc-90 54.61,60.96 | 54.61,60.96 D11.1 | v47.7,30.06 47.58,30.98 47.58,31.27 | 47.58,31.27 U1.30 | v21.21,34.29 21.21,35.43 21.19,35.51 | 21.19,35.51 v17.65,59.56 | v17.65,59.56 18.12,59.43 17.83,58.36 17.24,59.3 v17.65,59.56 | 23.02,59.38 21.91,59.54 v21.84,59.05 | 23.02,59.38 22.15,58.68 v21.84,59.05 | 21.19,35.51 20.76,34.48 v21.21,34.29 | 21.19,35.51 21.65,34.49 v21.21,34.29 | 47.58,31.27 47.23,30.21 v47.7,30.06 | 47.58,31.27 48.12,30.29 v47.7,30.06
  Bottom 0.406: v17.65,59.56 18.86,59.42 | 18.86,59.42 v21.84,59.05 | v21.21,34.29 21.67,33.68 arc5 21.96,33.33 | 21.96,33.33 arc48 25.53,31.75 44.41,31.75 arc-32 46.65,31.1 arc-13 47.36,30.53 v47.7,30.06 | 18.86,59.42 17.9,59.98 v17.65,59.56 | 18.86,59.42 17.79,59.1 v17.65,59.56 | v21.84,59.05 21.6,58.63 20.63,59.2 21.7,59.52 v21.84,59.05 | 21.96,33.33 21.68,34.41 v21.21,34.29 | 21.96,33.33 20.98,33.86 v21.21,34.29 | v47.7,30.06 47.23,29.9 46.87,30.95 47.89,30.5 v47.7,30.06
M4  (via drill 0.81)
  Top 0.406: 56.52,81.28 63.23,81.28 arc17 63.99,81.4 D16.1 | v28.07,81.53 29.28,81.43 | 29.28,81.43 31.11,81.28 | 31.11,81.28 43.81,81.28 | 43.81,81.28 56.52,81.28 | 56.52,81.28 D12.1 | 31.11,81.28 D4.1 | 43.81,81.28 D8.1 | v45.72,35.56 46.46,34.82 arc-9 46.57,34.69 | 46.57,34.69 arc-36 46.78,34.05 U1.29 | 46.18,35.73 v45.72,35.56 | 46.18,35.73 46.57,34.69 | 45.54,35.11 46.57,34.69 | v45.72,35.56 45.54,35.11 | 29.28,81.43 28.3,81.96 v28.07,81.53 | 29.28,81.43 28.22,81.07 v28.07,81.53 | 46.18,35.73 46.57,34.69 | v45.72,35.56 46.18,35.73 | 45.54,35.11 46.57,34.69 | v45.72,35.56 45.54,35.11
  Bottom 0.406: v28.07,81.53 27.66,81.94 arc45 26.19,82.55 10.16,82.55 arc54 8.96,81.93 arc36 8.76,81.33 8.76,77.93 arc-51 7.81,75.95 3.74,72.71 arc51 2.54,70.22 2.54,60.14 arc28 2.75,59.3 2.98,58.87 arc56 4.9,57.56 25.7,55.27 arc-33 28.11,54.26 29.58,53.07 arc-9 29.84,52.82 44.2,36.73 arc13 44.72,36.26 | 44.72,36.26 arc1 44.75,36.24 v45.72,35.56 | v28.07,81.53 27.63,81.32 27.14,82.32 28.21,82 v28.07,81.53 | 44.72,36.26 45.3,35.31 v45.72,35.56 | 44.72,36.26 45.82,36.04 v45.72,35.56
N$1
  Top 0.406: R9.1 R10.2
  Top 0.508: R2.2 R9.1
N$2
  Top 0.406: R10.1 R11.2
  Top 0.508: R3.2 R10.1
N$3
  Top 0.406: R11.1 R12.2
  Top 0.508: R4.2 R11.1
N$4
  Top 0.406: R12.1 R13.2
  Top 0.508: R5.2 R12.1
N$5
  Top 0.406: R13.1 R14.2
  Top 0.508: R6.2 R13.1
N$6
  Top 0.406: R14.1 R15.2
  Top 0.508: R7.2 R14.1
N$7
  Top 0.406: R15.1 R16.2
  Top 0.508: R8.2 R15.1
N$8
  Top 0.406: 35.56,34.64 34.16,34.64 34.04,33.91
N$9
  Top 0.406: 35.54,35.44 33.12,35.44 33.15,35.18 33.53,35.18
N$11
  Top 0.406: 33.76,36.24 35.54,36.24
N$12
  Top 0.406: 34.02,44.25 35.63,44.25
N$13
  Top 0.406: S1.1 22.44,64.55 arc-45 22.86,63.55 D1.2
N$15
  Top 0.406: U1.24 42.78,30.4 arc45 44.42,27.72 Q1.1 | C2.2 46.74,21.71
  Top 0.508: 46.74,21.71 Q1.1
N$16
  Top 0.406: D2.2 S2.1
N$17
  Top 0.406: S3.1 28.79,64.55 arc-45 29.21,63.55 D3.2
N$18
  Top 0.406: D4.2 S4.1
N$19
  Top 0.406: S5.1 35.03,64.67 arc-45 D5.2
N$20
  Top 0.406: D6.2 S6.1
N$21
  Top 0.406: S7.1 41.38,64.67 arc-45 D7.2
N$22
  Top 0.406: D8.2 SW8.1
N$23
  Top 0.406: S9.1 47.84,64.55 arc-45 48.26,63.55 D9.2
N$24
  Top 0.406: D10.2 S10.1
N$25
  Top 0.406: D11.2 52.7,65.28 S11.1
N$26
  Top 0.406: D12.2 S12.1
N$27
  Top 0.406: 34.16,43.43 35.56,43.43
N$28
  Top 0.406: 34.07,42.64 35.47,42.64
N$29
  Top 0.406: 34.11,41.85 35.38,41.85
N$30
  Top 0.406: 34.11,41.04 35.38,41.04
N$31
  Top 0.406: 34.14,40.24 35.41,40.24
N$32
  Top 0.406: 50.69,45.04 53.23,45.04
N$33
  Top 0.406: D13.2 59.75,64.99 arc-67 S13.1
N$34
  Top 0.406: D14.2 62.87,79.49 S14.1
N$35
  Top 0.406: D15.2 67.2,64.86 arc18 66.01,65.73 S15.1
N$36
  Top 0.406: D16.2 67.77,80.18 arc-90 S16.1
N$37
  Top 0.406: 50.89,44.24 53.43,44.24
N$38
  Top 0.406: 50.8,43.43 54.36,43.43
N$39
  Top 0.406: 50.79,42.63 52.7,42.63 53.79,42.63 55.06,42.63
N$40
  Top 0.406: 50.93,32.51 50.93,34.67
N$41
  Top 0.406: 35.69,33.02 37.08,33.02
N$42
  Top 0.406: 37.97,33.02 37.97,31.62 36.96,31.62
N$43
  Top 0.406: 38.79,31.9 38.79,33.04
N$44
  Top 0.406: 43.58,30.64 43.58,32.8
N$45
  Top 0.406: 44.38,33.04 44.38,31.9 44.37,31.18 44.4,30.18
N$46
  Top 0.406: 45.18,30.2 45.18,32.94
N$47
  Top 0.406: 45.97,30.48 45.97,33.15
N$48
  Top 0.406: 46.78,32.56 46.78,31.55
N$50
  Top 0.406: 35.69,32.51 35.69,32.89
N$51
  Top 0.406: 35.56,32.51 35.56,33.15
N$52
  Top 0.406: 37.46,31.37 36.96,31.37 36.83,31.5 | 36.83,31.5 36.83,31.62 | 36.83,31.37 36.83,31.5
N$53
  Top 0.406: R18.2 R9.2
  Top 0.508: R1.2 R18.2
N$55
  Top 0.406: C1.2 37.08,21.71 | U1.23 41.98,30.02 arc-45 41.45,28.75 37.85,25.15 37.34,25.15 Q1.2
  Top 0.508: 37.08,21.71 Q1.2
N$56
  Top 0.406: 34.29,34.29 34.29,33.91
N$58
  Top 0.406: 50.8,31.75 50.8,33.02
N$59
  Top 0.406: 51.18,31.75 51.18,33.02
N$60
  Top 0.406: 50.8,31.62 51.18,31.62
N$61
  Top 0.406: 35.43,47.12 34.29,47.12 34.16,46.99 34.16,46.74 35.56,46.74
PB0  (via drill 0.81)
  Top 0.406: 64.13,76.2 S16.3 | 64.13,76.2 61.7,76.2 arc-45 60.43,76.73 59.05,78.1 S14.3 | 64.13,68.58 64.13,76.2 | 64.13,68.58 64.13,68.39 arc-45 63.37,66.54 S13.3 | 64.13,68.58 67.07,68.58 arc-63 68.34,67.79 S15.3 arc-90 71.12,65.4 71.12,62.18 | v39.88,45.47 39.5,43.09 arc-90 35.98,39.44 U1.10 | v71.12,60.96 71.12,62.18 | v39.88,45.47 40.29,45.2 39.69,44.26 39.41,45.34 v39.88,45.47 | 71.12,62.18 70.67,61.15 v71.12,60.96 | 71.12,62.18 71.57,61.15 v71.12,60.96
  Bottom 0.406: 71.12,59.74 v71.12,60.96 | 70.67,60.76 | v39.88,45.47 arc-15 40.03,46.67 | 40.03,46.67 arc-30 41.26,48.8 46.3,53.84 arc-45 60.54,59.74 71.12,59.74 | 40.03,46.67 39.46,45.72 v39.88,45.47 | 40.03,46.67 40.35,45.6 v39.88,45.47 | 71.12,59.74 | 71.12,59.74 71.57,60.76 | 71.57,60.76 | v71.12,60.96 71.57,60.76 | 71.12,59.74 70.67,60.76 | v71.12,60.96 70.67,60.76 | 71.57,60.76 71.12,59.74 | v71.12,60.96 71.57,60.76 | 70.67,60.76 71.12,59.74 | v71.12,60.96 70.67,60.76
PB1  (via drill 0.81)
  Top 0.406: 54.6,68.58 52.91,68.58 arc45 52.56,68.43 S9.3 50.31,66.04 v51.33,63.71 | 54.6,68.58 54.61,68.58 54.61,75.75 arc45 53.84,77.6 S12.3 52.07,77.47 arc-63 50.02,76.2 49,76.2 arc-45 47.73,76.73 46.35,78.1 S10.3 | 54.6,68.58 arc-45 56.52,66.8 S11.3 | v33.02,39.37 33.48,38.91 arc37 34,38.65 | 34,38.65 arc8 34.13,38.64 U1.11 | v46.99,57.15 46.46,57.15 arc-45 45.19,57.68 arc45 43.4,58.42 26.29,58.42 arc90 24.51,56.64 24.51,37.5 arc45 25.79,34.41 arc-45 26.16,33.51 26.16,29.83 arc45 26.78,28.34 arc45 27.75,27.94 28.31,27.94 arc45 28.76,28.13 29.33,28.69 arc45 29.46,29.02 29.46,34.87 arc-46 29.96,36.04 32.35,38.35 | 32.91,38.89 v33.02,39.37 | 32.35,38.35 32.91,38.89 | 34,38.65 33.44,39.61 v33.02,39.37 | 32.91,38.89 34,38.65 | v33.02,39.37 32.91,38.89 | 32.35,38.35 33.29,38.96 v33.02,39.37 | 32.35,38.35 32.54,39.45 v33.02,39.37 | v46.99,57.15 46.75,56.73 45.78,57.29 46.85,57.62 v46.99,57.15 | v51.33,63.71 50.84,63.71 50.84,64.82 51.66,64.06 v51.33,63.71
  Bottom 0.406: J1.3 31.22,41.91 arc-17 31.75,41.83 arc-73 33.02,40.11 v33.02,39.37 | v46.99,57.15 46.99,58.37 | 46.99,58.37 46.99,60.13 arc-90 v51.33,63.71 | v33.02,39.37 32.56,39.54 32.96,40.59 33.46,39.59 v33.02,39.37 | 46.99,58.37 46.54,57.34 v46.99,57.15 | 46.99,58.37 47.44,57.34 v46.99,57.15 | v51.33,63.71 51.16,63.25 50.11,63.64 51.11,64.14 v51.33,63.71
  Bottom 0.813: 30.73,42.38 31.75,41.83 30.67,41.41 J1.3 30.73,42.38
PB2  (via drill 0.81)
  Top 0.406: 40.01,68.58 S5.3 37.29,65.94 36.17,67.6 | 40.01,68.58 41.91,68.58 43.81,66.67 S7.3 | 40.01,68.58 41.24,69.81 arc45 41.91,71.43 41.91,76.25 arc45 41.49,77.25 SW8.3 40.01,78.1 38.47,76.57 arc-45 37.57,76.2 34.29,76.2 34.24,76.25 arc-45 33.66,77.67 S6.3 | 36.73,37.82 35.59,37.82 U1.12 | 36.73,37.82 36.75,37.82 v37.95,37.87 | v35.48,68.61 36.17,67.6 | 33.12,50.37 v33.96,51.26 | 32.23,49.45 33.12,50.37 | v31.39,48.56 32.23,49.45 | 36.73,37.82 37.77,37.42 v37.95,37.87 | 36.73,37.82 37.73,38.31 v37.95,37.87 | 32.23,49.45 31.2,49.01 v31.39,48.56 | 32.23,49.45 31.85,48.4 v31.39,48.56 | 33.12,50.37 34.15,50.81 v33.96,51.26 | 33.12,50.37 33.5,51.42 v33.96,51.26 | 36.17,67.6 35.96,68.69 v35.48,68.61 | 36.17,67.6 35.22,68.19 v35.48,68.61
  Bottom 0.406: 37.03,38.67 36.34,39.27 arc-49 34.92,42.4 34.92,43.47 arc45 33.86,46.05 32.92,46.99 32.24,47.69 | v37.95,37.87 37.03,38.67 | 32.24,47.69 v31.39,48.56 | 33.94,52.48 33.93,52.5 33.93,56.57 arc45 32.7,59.56 30.68,61.57 29.85,62.52 arc-41 29.57,63.26 29.57,64.48 arc-69 31.28,66.98 34.35,68.17 | v33.96,51.26 33.94,52.48 | 34.35,68.17 v35.48,68.61 | 37.03,38.67 37.51,37.66 v37.95,37.87 | 37.03,38.67 38.09,38.34 v37.95,37.87 | 32.24,47.69 31.85,48.73 v31.39,48.56 | 32.24,47.69 31.21,48.11 v31.39,48.56 | 33.94,52.48 33.51,51.44 v33.96,51.26 | 33.94,52.48 34.4,51.46 v33.96,51.26 | 34.35,68.17 35.46,68.12 v35.48,68.61 | 34.35,68.17 35.14,68.95 v35.48,68.61
PB3
  Top 0.406: S2.3 23.05,76.65 arc45 25.4,76.2 S4.3 arc-90 29.21,76.83 29.21,69.21 | 29.21,69.21 27.24,69.21 arc45 25.4,68.45 25.12,68.18 arc45 24.77,67.31 | 24.77,67.31 S1.3 | 29.21,69.21 S3.3 | U1.13 33.89,37.04 arc27 33.12,36.85 31.53,36.04 arc63 30.61,34.52 30.61,29.03 arc-67 29.72,26.92 26.33,26.92 arc-80 24.79,28.98 19.05,60.96 19.05,66.57 arc-45 19.58,67.84 19.79,68.05 arc-45 21.06,68.58 22.41,68.58 arc-45 24.26,67.81 24.77,67.31
PC0
  Top 0.33: U1.35 51.39,36.24 arc-90 51.94,35.56 51.94,28.31
  Top 0.406: R8.1 arc-90 51.94,28.31
PC1
  Top 0.305: R7.1 arc-90 52.7,29.96 52.7,36.19 arc90 51.86,37.04
  Top 0.33: 51.86,37.04 U1.36
PC2
  Top 0.254: R6.1 arc-90 53.34,32.12 53.34,36.83 arc90 52.33,37.84
  Top 0.406: 52.33,37.84 U1.37
PC3
  Top 0.254: R5.1 arc-90 53.98,34.02 53.98,37.59 arc90 52.93,38.64
  Top 0.406: 52.93,38.64 U1.38
PC4
  Top 0.254: R4.1 arc-90 54.61,35.93 54.61,38.1 arc90 53.27,39.44
  Top 0.406: 53.27,39.44 U1.39
PC5
  Top 0.305: R3.1 arc-90 55.24,37.83 55.24,39.16
  Top 0.406: U1.40 54.17,40.24 arc-90 55.24,39.16
PC6
  Top 0.406: R2.1 arc90 54.58,41.04 U1.41
PC7
  Top 0.406: R1.1 56.25,41.84 U1.42
RESET  (via drill 0.81)
  Top 0.406: U1.20 39.58,31.45 arc-45 39.49,31.24 37.48,30.5 arc-45 37.36,30.48 35.72,30.48 arc45 35.45,30.37 arc45 35.17,29.69 R17.1 arc-44 33.18,31.81 | v33.02,33.02 33.02,32.98 arc15 33.18,31.81 | 33.49,32.88 | 33.49,32.88 33.18,31.81 | v33.02,33.02 33.49,32.88 | 32.6,32.77 33.18,31.81 | v33.02,33.02 32.6,32.77 | JP1.6 73.66,90.8 arc96 70.99,93.78 68.81,93.78 arc45 53.03,87.24 arc-45 47.35,84.89 17.65,84.89 arc90 16.51,83.74 16.51,76.2 arc-90 13.06,72.75 10.29,72.75 | 15.96,61.87 15.85,61.75 arc43 15.57,61.03 15.57,46.15 arc59 16.71,44.16 | 15.96,61.87 v16.79,62.76 | v9.07,72.75 10.29,72.75 | v17.88,43.84 arc-31 16.71,44.16 | 33.49,32.88 33.18,31.81 | v33.02,33.02 33.49,32.88 | 32.6,32.77 33.18,31.81 | v33.02,33.02 32.6,32.77 | 10.29,72.75 9.26,73.19 v9.07,72.75 | 10.29,72.75 9.26,72.3 v9.07,72.75 | 15.96,61.87 16.99,62.32 v16.79,62.76 | 15.96,61.87 16.33,62.92 v16.79,62.76 | 16.71,44.16 17.58,43.46 v17.88,43.84 | 16.71,44.16 17.81,44.32 v17.88,43.84 | JP1.6 73.09,90.51 73.65,91.44 74.22,90.52 JP1.6
  Bottom 0.406: J1.5 29.78,45.51 29.63,45.72 arc56 28.45,46.35 26.04,46.35 arc90 25.4,45.72 25.4,44.6 | 25.4,44.6 25.4,39.18 arc63 27.51,35.78 31.93,33.57 | 31.93,33.57 v33.02,33.02 | v9.07,72.75 9.79,72.41 arc-35 12.78,69.66 16.18,63.82 | v16.79,62.76 16.18,63.82 | v17.88,43.84 19.09,43.96 | 19.09,43.96 25.4,44.6 | 31.93,33.57 32.64,32.71 v33.02,33.02 | 31.93,33.57 33.05,33.51 v33.02,33.02 | v9.07,72.75 9.44,73.06 10.16,72.21 9.05,72.26 v9.07,72.75 | 16.18,63.82 16.3,62.71 v16.79,62.76 | 16.18,63.82 17.08,63.16 v16.79,62.76 | 19.09,43.96 18.03,44.3 v17.88,43.84 | 19.09,43.96 18.12,43.41 v17.88,43.84
  Bottom 0.813: 29.78,45.51 29.95,44.37 J1.5 30.76,44.9 29.78,45.51
RXD
  Top 0.406: U1.2 33.14,45.84 arc-47 30.48,46.99 arc122 25.4,45.72 arc74 26.74,42.33 arc24 J1.4
  Top 0.813: 26.74,42.33 27.57,41.53 J1.4 27.89,42.44 26.74,42.33
TXD
  Top 0.406: J1.1 32.19,41.08 arc45 33.02,43.09 33.02,43.99 arc-45 33.35,44.78 arc-45 33.98,45.04 U1.3
VCC  (via drill 0.81)
  Top 0.406: U$7.P$1 U$8.P$1 | U$3.P$1 U$4.P$1 arc45 8.76,49.46 8.76,9.27 | 40.39,35.08 U1.21 40.38,31.39 arc-37 39.91,30 | 40.39,35.08 arc-59 41.16,36.16 45.02,37.64 arc59 46.78,47.21 U1.52 46.78,50.28 arc-45 47,50.81 51.52,55.33 arc-45 52.84,55.88 69.72,55.88 | v38.99,29.21 39.43,29.53 arc17 39.91,30 | 8.64,9.09 8.64,9.27 8.76,9.27 | U$7.P$1 74.33,54.81 73.89,55.25 arc45 72.37,55.88 69.72,55.88 | v27.94,29.86 27.94,31.08 | 27.94,31.08 27.94,38.1 J1.2 | v38.99,29.21 37.77,29.21 | 37.77,29.21 R17.2 | U1.64 37.18,50 C4.1 38.78,49.6 U1.62 38.78,46.86 40.15,46.86 arc-45 41.17,46.46 41.17,44.59 40.39,42.55 40.39,35.08 | 8.76,9.09 U$2.P$1 | U$1.P$1 8.76,9.09 | 8.76,9.09 8.76,9.27 | C3.2 69.61,55.76 69.72,55.88 | U$7.P$1 74.48,47.87 SV1.1 77.98,47.68 arc-90 80.14,45.52 | 80.14,45.52 80.14,9.07 | 80.14,45.52 80.14,45.64 | 80.14,9.07 82.71,9.07 U$6.P$1 | 80.14,9.07 74.5,9.07 U$5.P$1 | 39.91,30 38.85,29.68 v38.99,29.21 | 39.91,30 39.43,29 v38.99,29.21 | 37.77,29.21 38.79,28.76 v38.99,29.21 | 37.77,29.21 38.79,29.66 v38.99,29.21 | 27.94,31.08 27.49,30.05 v27.94,29.86 | 27.94,31.08 28.39,30.05 v27.94,29.86
  Top 0.813: 27.94,38.1 28.42,39.15 J1.2 27.46,39.15 27.94,38.1
  Bottom 0.254: 74.93,88.9 71.88,88.9
  Bottom 0.406: 27.94,25.4 26.27,25.4 arc45 24.26,24.57 11.97,12.27 arc45 11.18,10.36 11.18,9.09 | 27.94,25.4 33.23,25.4 arc45 36.55,26.78 38.13,28.35 | 38.13,28.35 v38.99,29.21 | 27.94,25.4 27.94,28.64 | 27.94,28.64 v27.94,29.86 | U$8.P$1 82.55,56.52 82.55,69.32 arc45 82.18,70.22 81.45,70.95 arc-45 80.9,72.28 80.9,81.62 arc47 78.21,84.96 77.98,84.96 | JP1.4 71.12,89.66 71.73,89.05 | 71.88,88.9 71.73,89.05 | JP1.7 75.3,88.53 | 75.3,88.53 74.93,88.9 | 11.18,9.09 | 77.98,84.96 | 77.98,84.96 arc-78 76.24,86.36 | 76.24,86.36 arc-12 76.2,86.74 JP1.7 | U$2.P$1 11,9.09 11.18,9.09 | 38.13,28.35 39.17,28.76 v38.99,29.21 | 38.13,28.35 38.53,29.39 v38.99,29.21 | 27.94,28.64 28.39,29.66 v27.94,29.86 | 27.94,28.64 27.49,29.66 v27.94,29.86 | 71.73,89.05 71.73,90.17 JP1.4 | 71.73,89.05 70.79,89.66 JP1.4 | 75.3,88.53 75.62,87.46 JP1.7 | 75.3,88.53 76.37,88.21 JP1.7 | 76.24,86.36 76.74,87.35 JP1.7 | 76.24,86.36 75.68,87.32 JP1.7

### Text on the board
121bmp: 032.la | 2011 | 0.1uF | 0.1uF | 220 | (.)v(.) | 1 | 0K | 1 | Ra | Rb | 10K | 22pF | charliex | ZG9udCB1c2UgYmFzZTY0